# EAGLE design zetasdr (EAGLE 9.6.2)
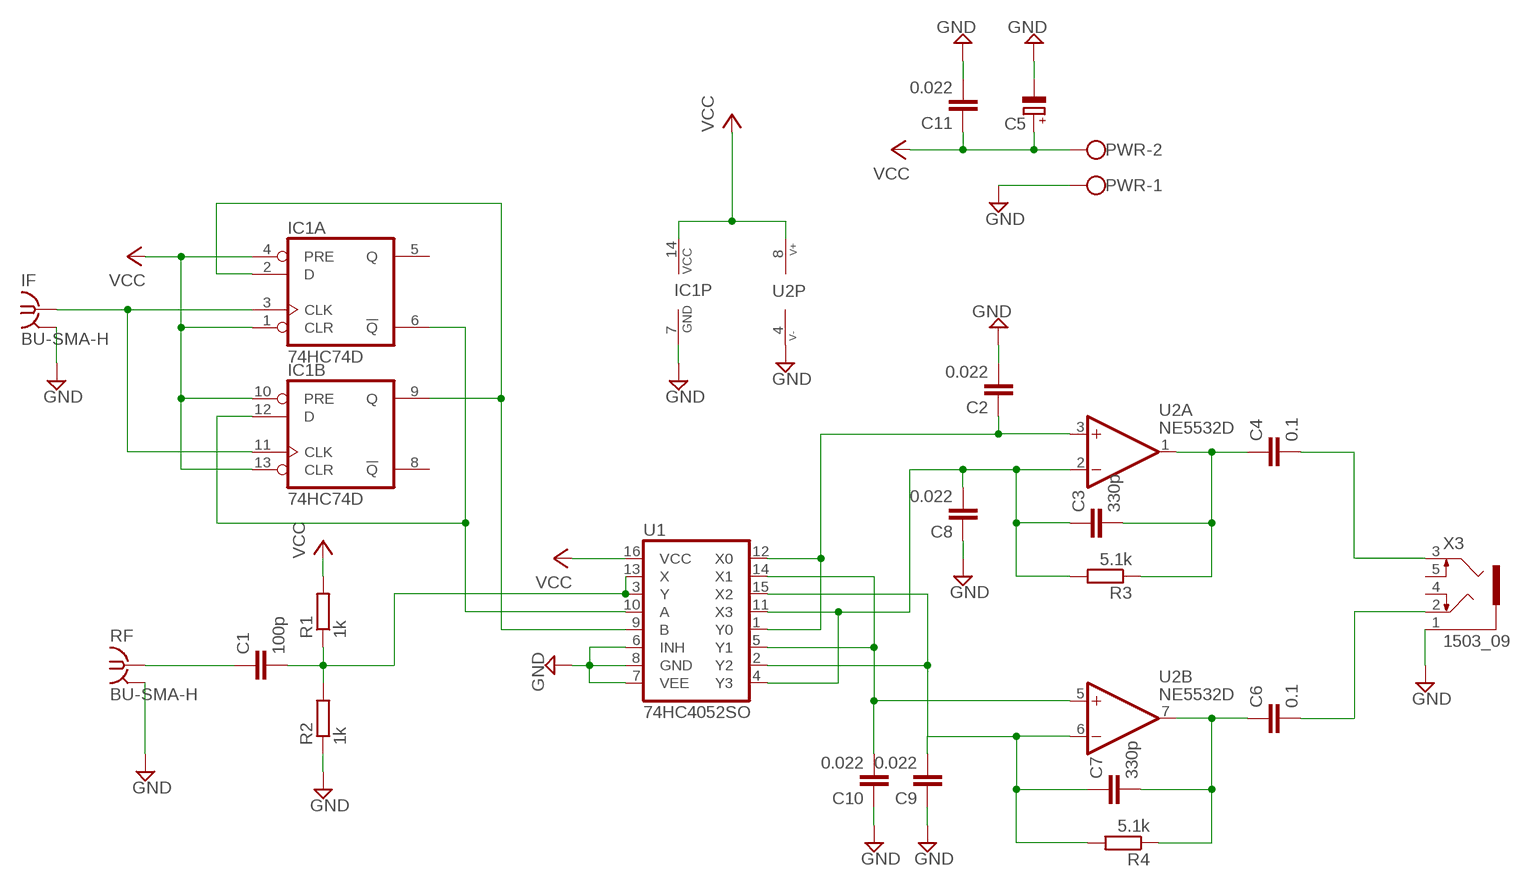
[diagram p0: schematic, sheet 1]

## Parts
C1  100p  C-EUC0805  [C0805]
C2  0.022  C-EUC0805  [C0805]
C3  330p  C-EUC0805  [C0805]
C4  0.1  C-EU050-045X075  [C050-045X075]
C5  CPOL-EUE3.5-8  [E3,5-8]
C6  0.1  C-EU050-045X075  [C050-045X075]
C7  330p  C-EUC0805  [C0805]
C8  0.022  C-EUC0805  [C0805]
C9  0.022  C-EUC0805  [C0805]
C10  0.022  C-EUC0805  [C0805]
C11  0.022  C-EUC0805  [C0805]
IC1  74HC74D  [SO14]
IF  BU-SMA-H  [BU-SMA-H]
PWR  W237-102  [W237-102]
R1  1k  R-EU_M0805  [M0805]
R2  1k  R-EU_M0805  [M0805]
R3  5.1k  R-EU_R0805  [R0805]
R4  5.1k  R-EU_R0805  [R0805]
RF  BU-SMA-H  [BU-SMA-H]
U1  74HC4052SO  [SO16]
U2  NE5532D  [SO08]
X3  1503_09  [1503_09]

## Nets
GND: C2.2 C5.- C8.1 C9.1 C10.1 C11.2 IC1.7(P:GND) IF.2 IF.3 IF.4 IF.5 PWR.1 R2.1 RF.2 RF.3 RF.4 RF.5 U1.6(INH) U1.7(VEE) U1.8(GND) U2.4(P:V-) X3.1
N$1: IC1.3(A:CLK) IC1.11(B:CLK) IF.1
N$2: IC1.6(A:!Q) IC1.12(B:D) U1.10(A)
N$3: IC1.2(A:D) IC1.9(B:Q) U1.9(B)
N$4: C1.1 RF.1
N$5: C1.2 R1.1 R2.2 U1.3(Y) U1.13(X)
N$6: C2.1 U1.1(Y0) U1.12(X0) U2.3(A:+IN)
N$7: C3.2 C4.1 R3.1 U2.1(A:OUT)
N$8: C3.1 C8.2 R3.2 U1.4(Y3) U1.11(X3) U2.2(A:-IN)
N$9: C4.2 X3.3
N$10: C10.2 U1.5(Y1) U1.14(X1) U2.5(B:+IN)
N$11: C6.1 C7.2 R4.1 U2.7(B:OUT)
N$12: C6.2 X3.2
N$13: C7.1 C9.2 R4.2 U1.2(Y2) U1.15(X2) U2.6(B:-IN)
VCC: C5.+ C11.1 IC1.1(A:CLR) IC1.4(A:PRE) IC1.10(B:PRE) IC1.13(B:CLR) IC1.14(P:VCC) PWR.2 R1.2 U1.16(VCC) U2.8(P:V+)
Unconnected: IC1.5(A:Q) IC1.8(B:!Q) X3.4 X3.5

## Library data of the parts
C1-C4 C6-C11 = rcl:C-EU: CAPACITOR, European symbol; SPICEPREFIX: C
C5 = rcl:CPOL-EU: POLARIZED CAPACITOR, European symbol; SPICEPREFIX: C
IC1 = 74xx-eu:74*74: Dual D type positive edge triggered FLIP FLOP, preset and clear
IF RF = con-coax:BU-SMA-H: FEMALE SMA CONNECTOR Radiall; OC_FARNELL: unknown; OC_NEWARK: unknown
PWR = con-wago-500:W237-102: WAGO SCREW CLAMP; MPN: 237-102; OC_FARNELL: unknown; OC_NEWARK: 70K9898
R1-R4 = rcl:R-EU_: RESISTOR, European symbol; SPICEPREFIX: R
U1 = 74HC4052:74HC4052: Dual 4:1 analog mux Check prices <https://pricing.snapeda.com/parts/74HC4052/Nexperia%20USA/view-part?ref=eda>; AVAILABILITY: In Stock; DESCRIPTION: 2 Circuit IC Switch 4:1 150Ohm 16-DHVQFN (2.5x3.5); MF: Nexperia USA; MP: 74HC4052; PACKAGE: DIP-16 NXP Semiconductors; PRICE: None; PURCHASE-URL: https://pricing.snapeda.com/search/part/74HC4052/?ref=eda
U2 = op-amp:NE5532: OP-AMP
X3 = con-lumberg:1503_09: Jack connectors according to JISC 6560, 3.5 mm Klinkeneinbaukupplung nach JISC 6560, 3,5 mm, 3-polig/ stereo, abgewinkelte Ausführung, mit 2 Öffnern und Lötaugen, für Leiterplatten Rückseitenmontage Source: http://www.lumberg.com/Produkte/PDFs/1503_09.pdf; OC_FARNELL: 1243244; OC_NEWARK: unknown

## Board
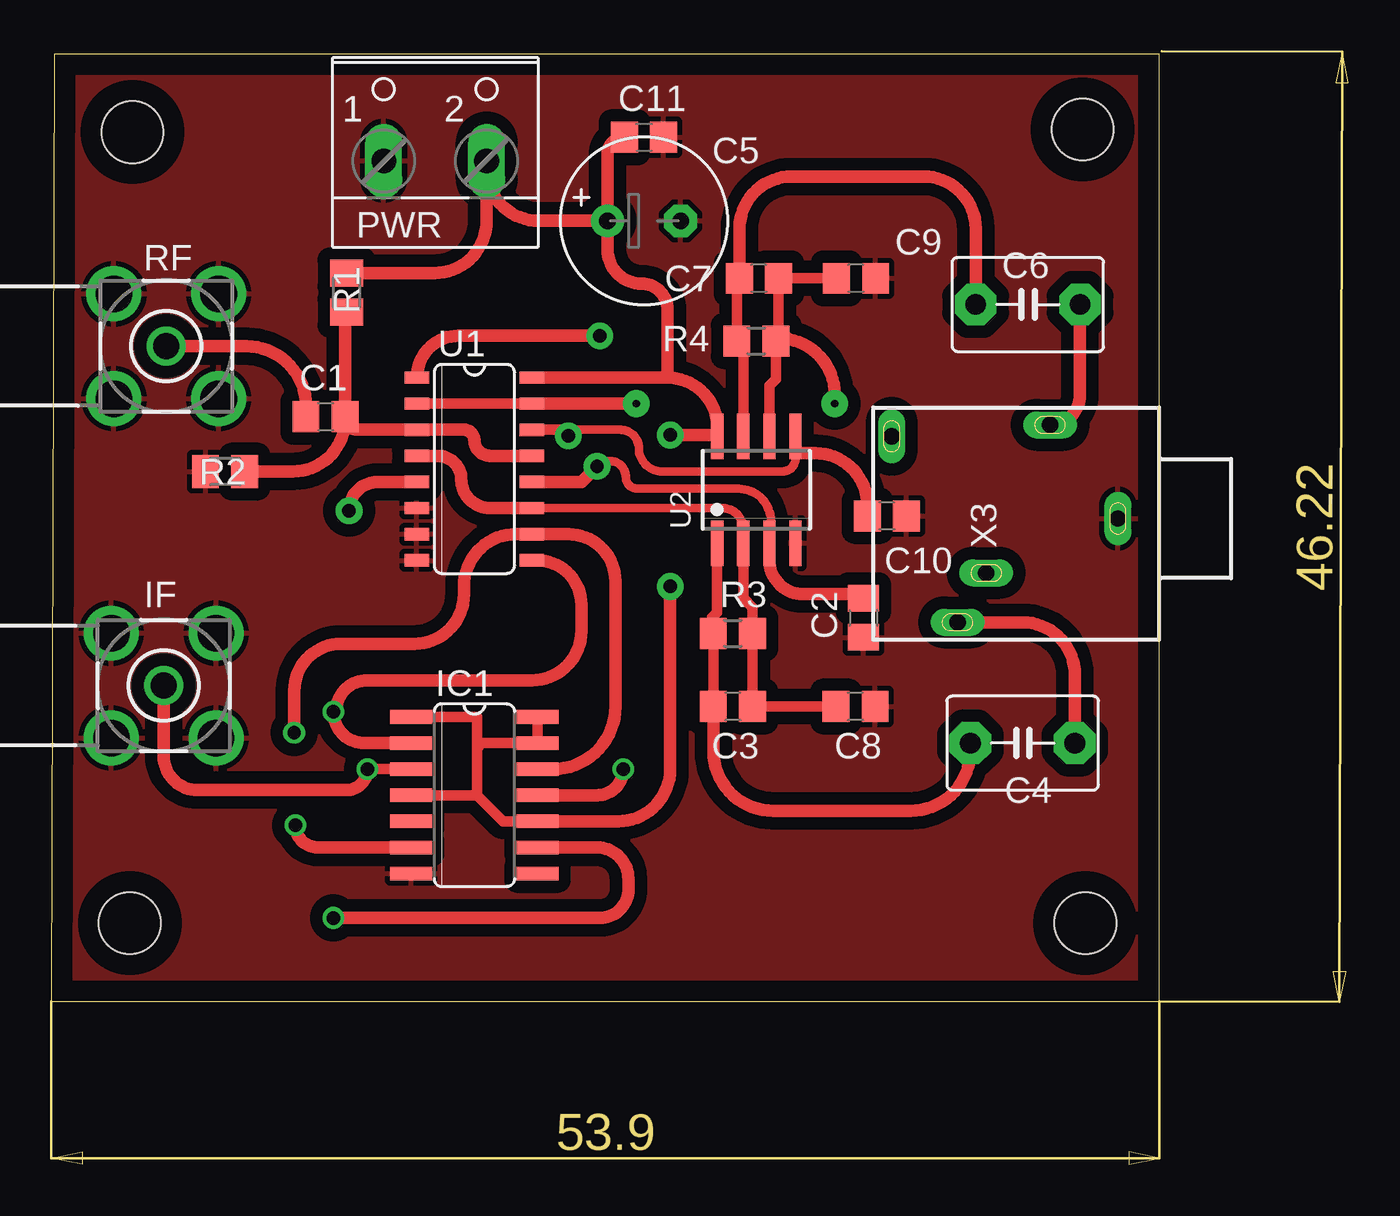
[diagram p1: board, top side]
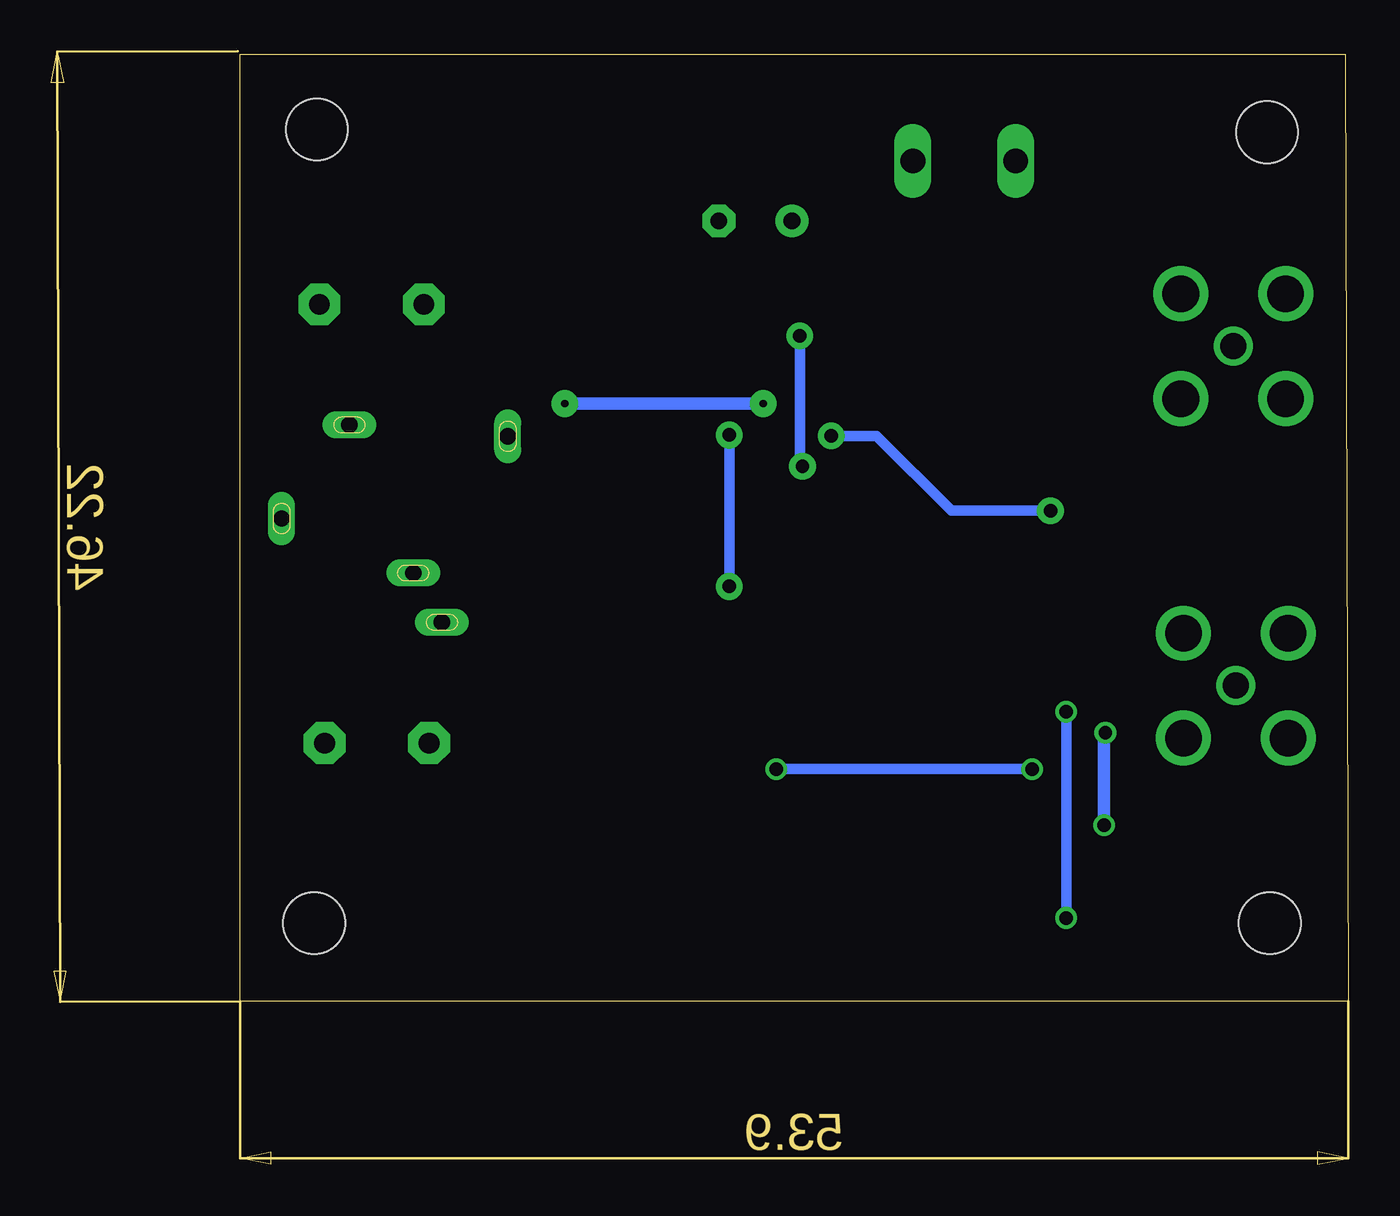
[diagram p2: board, bottom side, seen from below]

Size 53.9 x 46.09 mm. Coordinates in mm from the lower left corner, seen from the top.
Outline: 0,0 53.9,0 53.9,46.09 0.13,46.09 0,0
Copper layers (1*16): Top 0.035mm / dielectric 1.5mm / Bottom 0.035mm
Design rules "default": minimum track width 6mil, minimum drill 0.35mm, track to track 6mil, track to pad 6mil, pad to pad 6mil, via to via 6mil, smd to smd 6mil, copper to edge 40mil, drill to drill 6mil, minimum pad ring 10mil, minimum via ring 8mil, stop-mask expansion 4mil, vias tented up to drill 0mil, thermal gap 10mil
Holes 3 mm at 3.81,3.81 50.16,42.42 50.29,3.81 3.94,42.29

### Footprints (pad centres in the part's own frame; a part is rotated, then mirrored left to right if it is on the bottom)
C0805 = smd 1.3 x 1.5: 1 -0.95,0; 2 0.95,0
C050-045X075 = drill 1 pad 2.032 octagon: 1 -2.54,0; 2 2.54,0
E3,5-8 = drill 0.813 pad 1.6: + -1.778,0 | drill 0.813 pad 1.6 octagon: - 1.778,0
SO14 = smd 0.66 x 2.032: 1 -3.81,-3.073; 2 -2.54,-3.073; 3 -1.27,-3.073; 4 0,-3.073; 5 1.27,-3.073; 6 2.54,-3.073; 7 3.81,-3.073; 8 3.81,3.073; 9 2.54,3.073; 10 1.27,3.073; 11 0,3.073; 12 -1.27,3.073; 13 -2.54,3.073; 14 -3.81,3.073
BU-SMA-H = drill 1.27: 1 0,0 | drill 1.778: 2 -2.55,2.55; 3 2.55,2.55; 4 2.55,-2.55; 5 -2.55,-2.55
W237-102 = drill 1.194 long: 1 -2.5,-1.27; 2 2.5,-1.27
M0805 = smd 1.3 x 1.6: 1 -0.95,0; 2 0.95,0
R0805 = smd 1.3 x 1.5: 1 -0.95,0; 2 0.95,0
SO16 = smd 0.6 x 1.2: 1 -4.445,-2.8; 2 -3.175,-2.8; 3 -1.905,-2.8; 4 -0.635,-2.8; 5 0.635,-2.8; 6 1.905,-2.8; 7 3.175,-2.8; 8 4.445,-2.8; 9 4.445,2.8; 10 3.175,2.8; 11 1.905,2.8; 12 0.635,2.8; 13 -0.635,2.8; 14 -1.905,2.8; 15 -3.175,2.8; 16 -4.445,2.8
SO08 = smd 0.6 x 2.2: 1 -1.905,-2.6; 2 -0.635,-2.6; 3 0.635,-2.6; 4 1.905,-2.6; 5 1.905,2.6; 6 0.635,2.6; 7 -0.635,2.6; 8 -1.905,2.6
1503_09 = drill 0.8 pad 1.2 long: 1 0,-2.1; 2 -4.55,-5.4; 3 5.05,-9.9; 4 -4,-13.1; 5 2.65,-8.5

### Placement (x,y rotation side)
C1  13.34,28.45 0 top
C2  39.5,18.67 270 top
C3  33.15,14.35 180 top
C4  47.24,12.57 0 top
C5  28.83,37.97 0 top
C6  47.5,33.91 0 top
C7  34.42,35.18 180 top
C8  39.12,14.35 180 top
C9  39.14,35.18 180 top
C10  40.64,23.62 180 top
C11  28.83,42.04 0 top
IC1  20.57,10.03 270 top
IF  5.46,15.37 180 top
PWR  18.67,42.16 0 top
R1  14.35,34.48 90 top
R2  8.45,25.78 0 top
R3  33.15,17.91 0 top
R4  34.29,32.13 0 top
RF  5.59,31.88 180 top
U1  20.57,25.91 270 top
U2  34.29,24.89 0 top
X3  53.98,23.5 270 top

### Tracks (layer width: path | path; a pad name or v marks a point on that pad's centre or on a via)
GND
  pour Top (isolate 0.61): -1.27,51.31 -1.27,-1.78 69.6,-1.78 69.6,51.31
N$1  (via drill 0.65)
  Top 0.508: v15.37,11.3 IC1.3
  Top 0.61: IF.1 5.46,11.94 arc90 7.11,10.29 14.35,10.29 arc90 v15.37,11.3 | IC1.11 26.54,10.03 arc90 v27.81,11.3
  Bottom 0.508: v27.81,11.3 v15.37,11.3
N$2  (via drill 0.65)
  Top 0.61: IC1.12 24.38,11.3 arc90 27.43,14.35 27.43,20.45 arc90 25.15,22.73 U1.10 22.61,22.73 arc90 20.07,20.19 20.07,19.81 arc-90 17.65,17.4 14.1,17.4 arc90 11.81,15.11 v11.81,13.08 | IC1.6 12.95,7.49 arc-90 v11.87,8.57
  Bottom 0.61: v11.81,13.08 11.87,13.14 v11.87,8.57
N$3  (via drill 0.65)
  Top 0.61: IC1.2 15.24,12.57 arc-90 v13.72,14.1 13.84,14.1 arc-90 15.37,15.62 23.37,15.62 arc90 25.78,18.03 25.78,19.3 arc90 23.62,21.46 U1.9 | v13.72,4.06 26.67,4.06 arc90 28.07,5.46 28.07,5.97 arc90 26.54,7.49 IC1.9
  Bottom 0.508: v13.72,14.1 v13.72,4.06
N$4
  Top 0.61: RF.1 9.46,31.88 arc-90 12.38,28.96 C1.1
N$5
  Top 0.61: C1.2 arc90 14.92,27.81 U1.3 20.07,27.81 arc-90 20.57,27.3 arc90 21.34,26.54 U1.13 | R2.2 11.74,25.78 arc90 14.29,28.32 C1.2 | C1.2 14.29,33.47 arc-90 R1.1
N$6  (via drill 0.65 pad 1.3)
  Top 0.406: U2.3 35,22.36 35,23.37 arc90 33.42,24.94 28.52,24.94 arc-90 27.94,25.53 arc90 27.18,26.29 26.8,26.29 v26.54,26.04
  Top 0.61: U1.1 arc-90 19.81,32.38 v26.67,32.38 | v26.54,26.04 25.78,25.27 U1.12 | U2.3 34.92,21.46 arc90 36.58,19.81 39.56,19.81 arc90 C2.1
  Bottom 0.508: v26.67,32.38 26.67,26.16 v26.54,26.04
N$7
  Top 0.508: U2.1 32.38,18.92 32.13,18.67 32.13,17.97 R3.1 C3.2
  Top 0.61: C4.1 44.7,12.19 arc-90 41.78,9.27 35.12,9.27 arc-90 32.2,12.19 C3.2
N$8
  Top 0.406: U1.11 32.64,24 arc-90 33.66,22.99 U2.2
  Top 0.508: U2.2 33.66,19.62 34.1,19.18 R3.2 C3.1 C8.2
  Top 0.61: U1.4 18.8,26.54 arc-90 19.94,25.4 arc90 21.34,24 U1.11
N$9
  Top 0.61: C4.2 49.78,15.9 arc90 47.24,18.45 X3.3
N$10  (via drill 0.65 pad 1.3)
  Top 0.406: 25.15,27.81 27.69,27.81 arc-90 28.57,26.92 arc90 29.72,25.78 35.56,25.78 arc90 36.2,26.42 36.2,26.67 U2.5
  Top 0.508: 25.15,27.81 v25.15,27.51 24.85,27.81 U1.14
  Top 0.61: v14.48,23.88 arc-90 15.88,25.27 U1.5 | C10.2 39.69,24.13 arc90 37.15,26.67 36.2,26.67
  Bottom 0.508: v14.48,23.88 19.3,23.88 22.94,27.51 v25.15,27.51
N$11
  Top 0.508: U2.7 33.66,31.82 R4.1 33.34,35.05 C7.2
  Top 0.61: C6.1 44.96,37.59 arc90 42.42,40.13 36.01,40.13 arc90 33.47,37.59 C7.2
N$12
  Top 0.61: X3.2 arc90 50.04,29.51 C6.2
N$13  (via drill 0.35 pad 1.3)
  Top 0.508: U2.6 34.92,29.97 35.24,30.29 R4.2 35.37,32.26 C7.1 C9.2 | U1.2 U1.15
  Top 0.61: v38.1,29.08 38.1,29.52 arc90 35.37,32.26 | v28.45,29.08 U1.15
  Bottom 0.61: v38.1,29.08 v28.45,29.08
VCC  (via drill 0.65 pad 1.3)
  Top 0.508: IC1.10 21.97,8.76 20.7,10.03 | 20.7,10.03 IC1.4 | 20.7,10.03 20.7,12.32 | 20.7,12.32 20.7,13.84 IC1.1 | IC1.14 IC1.13 20.95,12.57 20.7,12.32
  Top 0.61: v30.1,27.56 32.32,27.56 arc-90 U2.8 32.38,27.94 arc90 29.97,30.35 | IC1.10 27.56,8.76 arc90 30.1,11.3 v30.1,20.19 | U1.16 29.97,30.35 | C11.1 arc90 27.05,41.21 C5.+ | C5.+ 23.71,37.97 arc-90 21.17,40.51 PWR.2 21.17,37.97 arc-90 18.63,35.43 R1.2 | C5.+ 27.05,36.58 arc90 28.7,34.92 arc-90 29.97,33.66 29.97,30.35
  Bottom 0.508: v30.1,20.19 v30.1,27.56